# EAGLE design lcd-power-distribution (EAGLE 7.7.0)
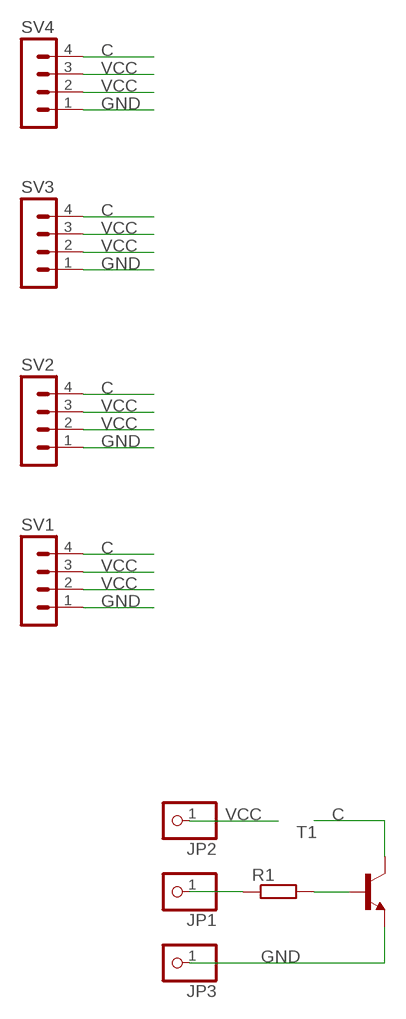
[diagram p0: schematic, sheet 1]

## Parts
JP1  PINHD-1X1  [1X01]
JP2  PINHD-1X1  [1X01]
JP3  PINHD-1X1  [1X01]
R1  R-EU_0207/7  [0207/7]
SV1  MA04-1  [MA04-1]
SV2  MA04-1  [MA04-1]
SV3  MA04-1  [MA04-1]
SV4  MA04-1  [MA04-1]
T1  2N3904-NPN-TO92-EBC  [TO92-EBC]

## Nets
C: SV1.4 SV2.4 SV3.4 SV4.4 T1.C
GND: JP3.1 SV1.1 SV2.1 SV3.1 SV4.1 T1.E
N$1: JP1.1 R1.1
N$2: R1.2 T1.B
VCC: JP2.1 SV1.2 SV1.3 SV2.2 SV2.3 SV3.2 SV3.3 SV4.2 SV4.3

## Library data of the parts
JP1-JP3 = pinhead:PINHD-1X1: PIN HEADER
R1 = rcl:R-EU_: RESISTOR, European symbol
SV1-SV4 = con-lstb:MA04-1: PIN HEADER; OC_FARNELL: unknown; OC_NEWARK: unknown
T1 = transistor-neu-to92:*-NPN-: NPN Transistror

## Board
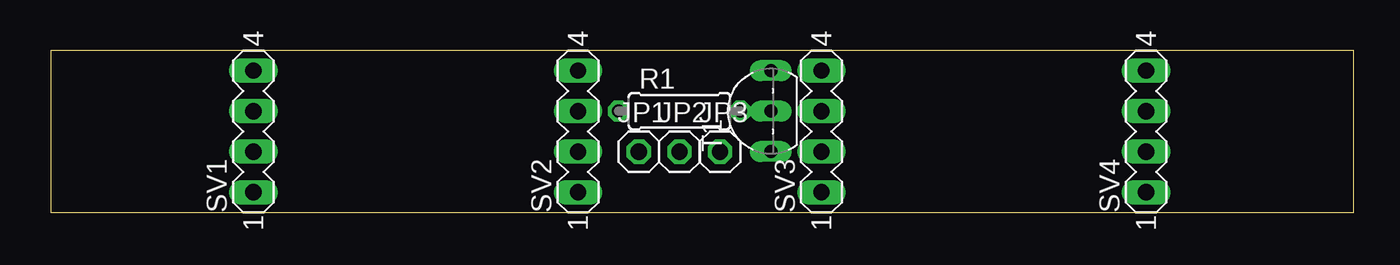
[diagram p1: board, top side]
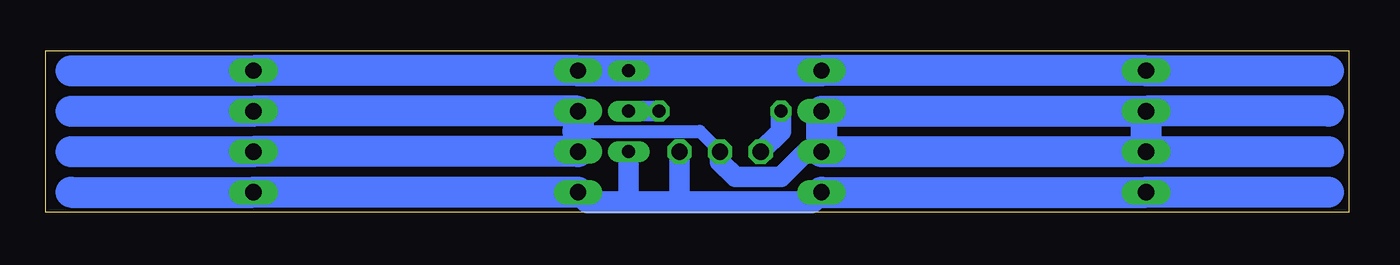
[diagram p2: board, bottom side, seen from below]

Size 81.58 x 10.15 mm. Coordinates in mm from the lower left corner, seen from the top.
Outline: 0,0 81.58,0 81.58,10.15 0,10.15 0,0
Copper layers (1*16): Top 0.035mm / dielectric 1.5mm / Bottom 0.035mm
Design rules "default": minimum track width 10mil, minimum drill 24mil, track to track 8mil, track to pad 8mil, pad to pad 8mil, via to via 8mil, smd to smd 8mil, copper to edge 40mil, drill to drill 8mil, minimum pad ring 10mil, minimum via ring 8mil, stop-mask expansion 4mil, vias tented up to drill 0mil, thermal gap 10mil

### Footprints (pad centres in the part's own frame; a part is rotated, then mirrored left to right if it is on the bottom)
1X01 = drill 1.016 octagon: 1 0,0
0207/7 = drill 0.813 octagon: 1 -3.81,0; 2 3.81,0
MA04-1 = drill 1.016 long: 1 -3.81,0; 2 -1.27,0; 3 1.27,0; 4 3.81,0
TO92-EBC = drill 0.813 long: B 0,-1.27; C 2.54,-1.27; E -2.54,-1.27

### Placement (x,y rotation side)
JP1  36.83,3.81 0 top
JP2  39.37,3.81 0 top
JP3  41.91,3.81 0 top
R1  39.37,6.35 0 top
SV1  12.7,5.08 90 top
SV2  33.02,5.08 90 top
SV3  48.26,5.08 90 top
SV4  68.58,5.08 90 top
T1  43.81,6.35 90 top

### Tracks (layer width: path | path; a pad name or v marks a point on that pad's centre or on a via)
C
  Bottom 1.93: 1.27,8.89 SV1.4 SV2.4 T1.C SV3.4 SV4.4 80.01,8.89
GND
  Bottom 1.27: T1.E 45.09,0.64 | JP3.1 41.91,0.64
  Bottom 1.422: SV2.1 33.66,0.64 41.91,0.64 45.09,0.64 47.62,0.64 SV3.1
  Bottom 1.93: SV2.1 SV1.1 1.27,1.27 | SV3.1 SV4.1 80.01,1.27
N$1
  Bottom 1.27: R1.1 35.56,5.08 JP1.1
N$2
  Bottom 1.27: T1.B R1.2
VCC
  Bottom 0.813: 48.26,5.08 40.64,5.08 JP2.1
  Bottom 1.27: SV2.2 33.97,3.81 35.56,2.22 38.42,2.22 39.37,3.17 JP2.1 | SV3.2 48.26,5.08
  Bottom 1.93: SV1.2 SV2.2 SV2.3 SV1.3 | SV1.2 1.27,3.81 | 80.01,6.35 SV4.3 SV3.3 48.26,5.08 | SV3.2 SV4.2 80.01,3.81 | 1.27,6.35 SV1.3 | SV1.2 SV1.3